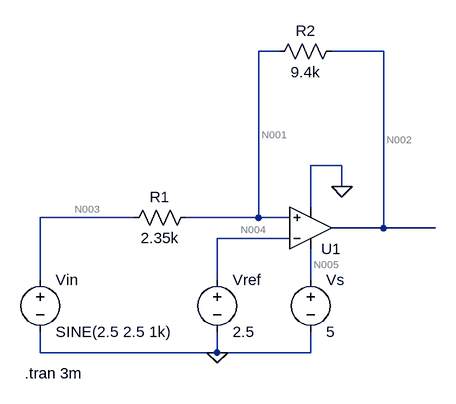
[diagram p0: schematic Schmitt Trigger.asc]
Schmitt Trigger.asc, the LTspice schematic file:
Version 4
SHEET 1 880 680
WIRE 96 -128 64 -128
WIRE 256 -128 176 -128
WIRE 192 48 144 48
WIRE 192 80 192 48
WIRE 144 112 144 48
WIRE -128 128 -272 128
WIRE 64 128 64 -128
WIRE 64 128 -48 128
WIRE 112 128 64 128
WIRE 256 144 256 -128
WIRE 256 144 176 144
WIRE 336 144 256 144
WIRE 112 160 0 160
WIRE -272 224 -272 128
WIRE 0 224 0 160
WIRE 144 224 144 176
WIRE -272 336 -272 304
WIRE 0 336 0 304
WIRE 0 336 -272 336
WIRE 144 336 144 304
WIRE 144 336 0 336
FLAG 0 336 0
FLAG 192 80 0
SYMBOL res 192 -144 R90
WINDOW 0 0 56 VBottom 2
WINDOW 3 32 56 VTop 2
SYMATTR InstName R2
SYMATTR Value 9.4k
SYMBOL res -32 112 R90
WINDOW 0 0 56 VBottom 2
WINDOW 3 32 56 VTop 2
SYMATTR InstName R1
SYMATTR Value 2.35k
SYMBOL voltage 0 208 R0
WINDOW 123 0 0 Left 2
WINDOW 39 0 0 Left 2
SYMATTR InstName Vref
SYMATTR Value 2.5
SYMBOL voltage -272 208 R0
WINDOW 123 0 0 Left 2
WINDOW 39 0 0 Left 2
SYMATTR InstName Vin
SYMATTR Value SINE(2.5 2.5 1k)
SYMBOL voltage 144 208 R0
WINDOW 123 0 0 Left 2
WINDOW 39 0 0 Left 2
SYMATTR InstName Vs
SYMATTR Value 5
SYMBOL Opamps\\UniversalOpamp2 144 144 M180
SYMATTR InstName U1
TEXT -296 368 Left 2 !.tran 3m

The netlist it stands for:
* Schmitt Trigger.asc
R2 N002 N001 9.4k
R1 N001 N003 2.35k
Vref N004 0 2.5
Vin N003 0 SINE(2.5 2.5 1k)
Vs N005 0 5
XU1 N001 N004 N005 0 N002 level.2 Avol=1Meg GBW=10Meg Slew=10Meg ilimit=25m rail=0 Vos=0 phimargin=45 en=0 enk=0 in=0 ink=0 Rin=500Meg  ; pins IN+ IN- V+ V- OUT
.tran 3m
.lib UniversalOpamps2.sub
.backanno
.end

* Results of the author's LTspice run, read from the files saved beside the schematic
* Operating Point, zero values left out:
*   V(n002) = 2.5 V
*   V(n001) = 2.5 V
*   V(n003) = 2.5 V
*   V(n004) = 2.5 V
*   V(n005) = 5 V
*   I(Vs) = -250 µA
*   Ix(u1:3) = 250 µA
*   Ix(u1:4) = -250 µA
*   Ix(u1:5) = 198.2 pA
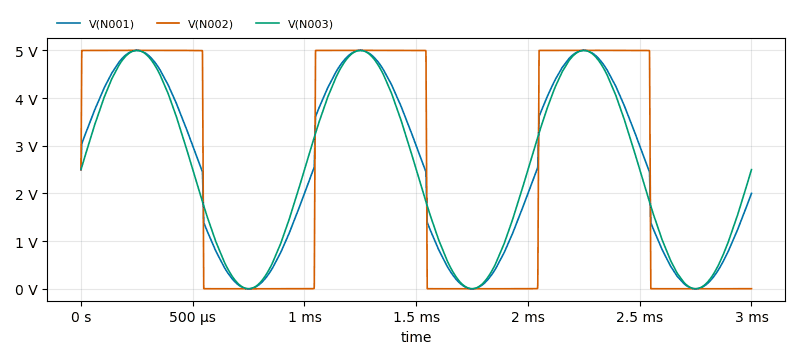
[diagram p1: Transient Analysis of Schmitt Trigger.asc, plotted from the saved traces]
* Transient Analysis, 1 run:
*   V(N001): min 180.1 µV, max 5 V, average 2.515 V, rms 3.132 V, last 2 V
*   V(N002): min 6.164 µV, max 5 V, average 2.575 V, rms 3.582 V, last 2.328 mV
*   V(N003): min 211.8 µV, max 5 V, average 2.5 V, rms 3.065 V, last 2.5 V